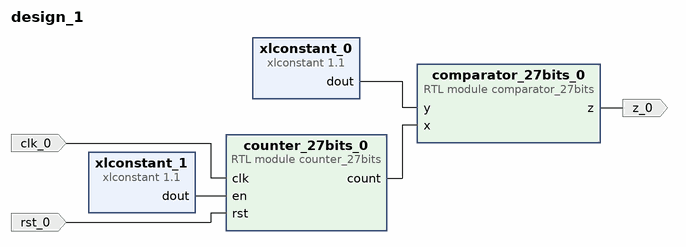
[diagram p0: block diagram of the top level]
# Vivado block design design_1, xc7z020clg400-1, Vivado 2018.3
create_bd_design design_1

create_bd_port -dir I -type clk clk_0
create_bd_port -dir I -type rst rst_0
create_bd_port -dir O z_0

create_bd_cell -type module -reference comparator_27bits comparator_27bits_0
create_bd_cell -type module -reference counter_27bits counter_27bits_0
create_bd_cell -type ip -vlnv xilinx.com:ip:xlconstant:1.1 xlconstant_0
set_property -dict {CONFIG.CONST_VAL 62500000 CONFIG.CONST_WIDTH 27} [get_bd_cells xlconstant_0]
create_bd_cell -type ip -vlnv xilinx.com:ip:xlconstant:1.1 xlconstant_1

# ---- connections ----

connect_bd_net [get_bd_pins counter_27bits_0/count] [get_bd_pins comparator_27bits_0/x]
connect_bd_net [get_bd_pins xlconstant_0/dout] [get_bd_pins comparator_27bits_0/y]
connect_bd_net [get_bd_pins xlconstant_1/dout] [get_bd_pins counter_27bits_0/en]
connect_bd_net -net clk_0_1 [get_bd_ports clk_0] [get_bd_pins counter_27bits_0/clk]
connect_bd_net -net rst_0_1 [get_bd_ports rst_0] [get_bd_pins counter_27bits_0/rst]
connect_bd_net [get_bd_pins comparator_27bits_0/z] [get_bd_ports z_0]

validate_bd_design
save_bd_design
